# Altium project ESC_Board_Prj.PrjPcb (part 1 of 2)
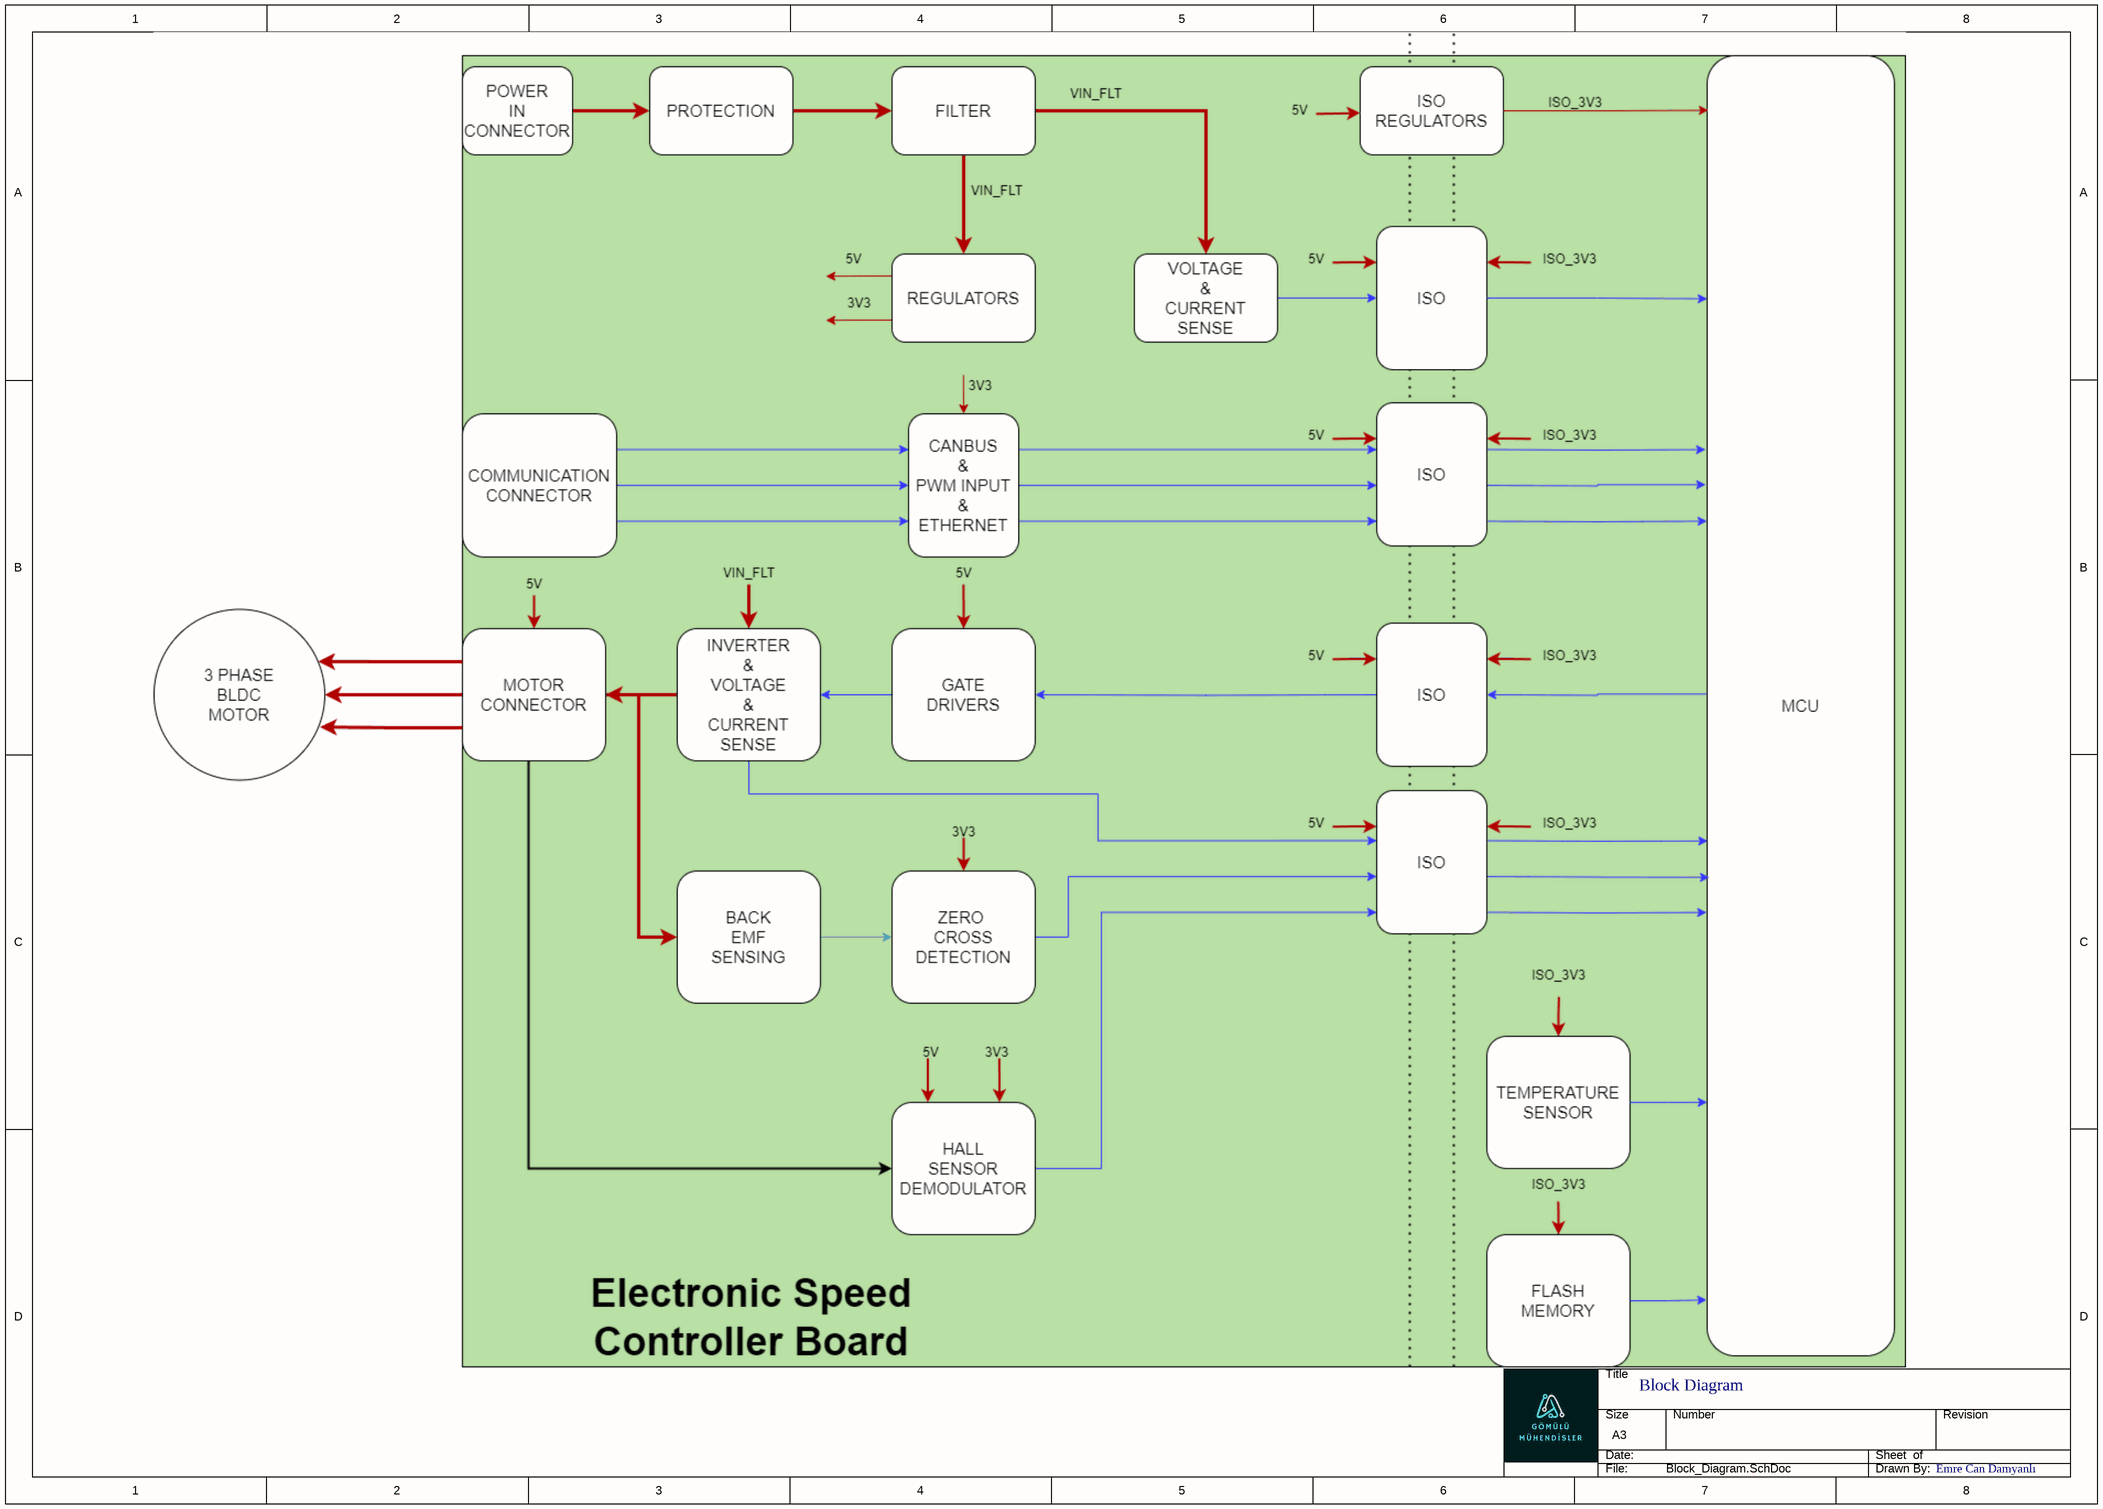
[diagram p0: Block_Diagram.SchDoc]
5 sheets, 72 parts. Net scope: global (net labels, ports and power ports of the same name join across sheets).
Sheets:
  Block_Diagram.SchDoc
  Power_In.SchDoc
  Filter.SchDoc
  Non_Iso_Regulators.SchDoc
  Iso_Regulators.SchDoc

## Sheet Block_Diagram.SchDoc
size A3; SheetNumber: 1; SheetTotal: 4

### Notes on the sheet
- Block Diagram
- Emre Can Damyanlı

## Sheet Power_In.SchDoc
size A4; SheetNumber: 2; SheetTotal: 5
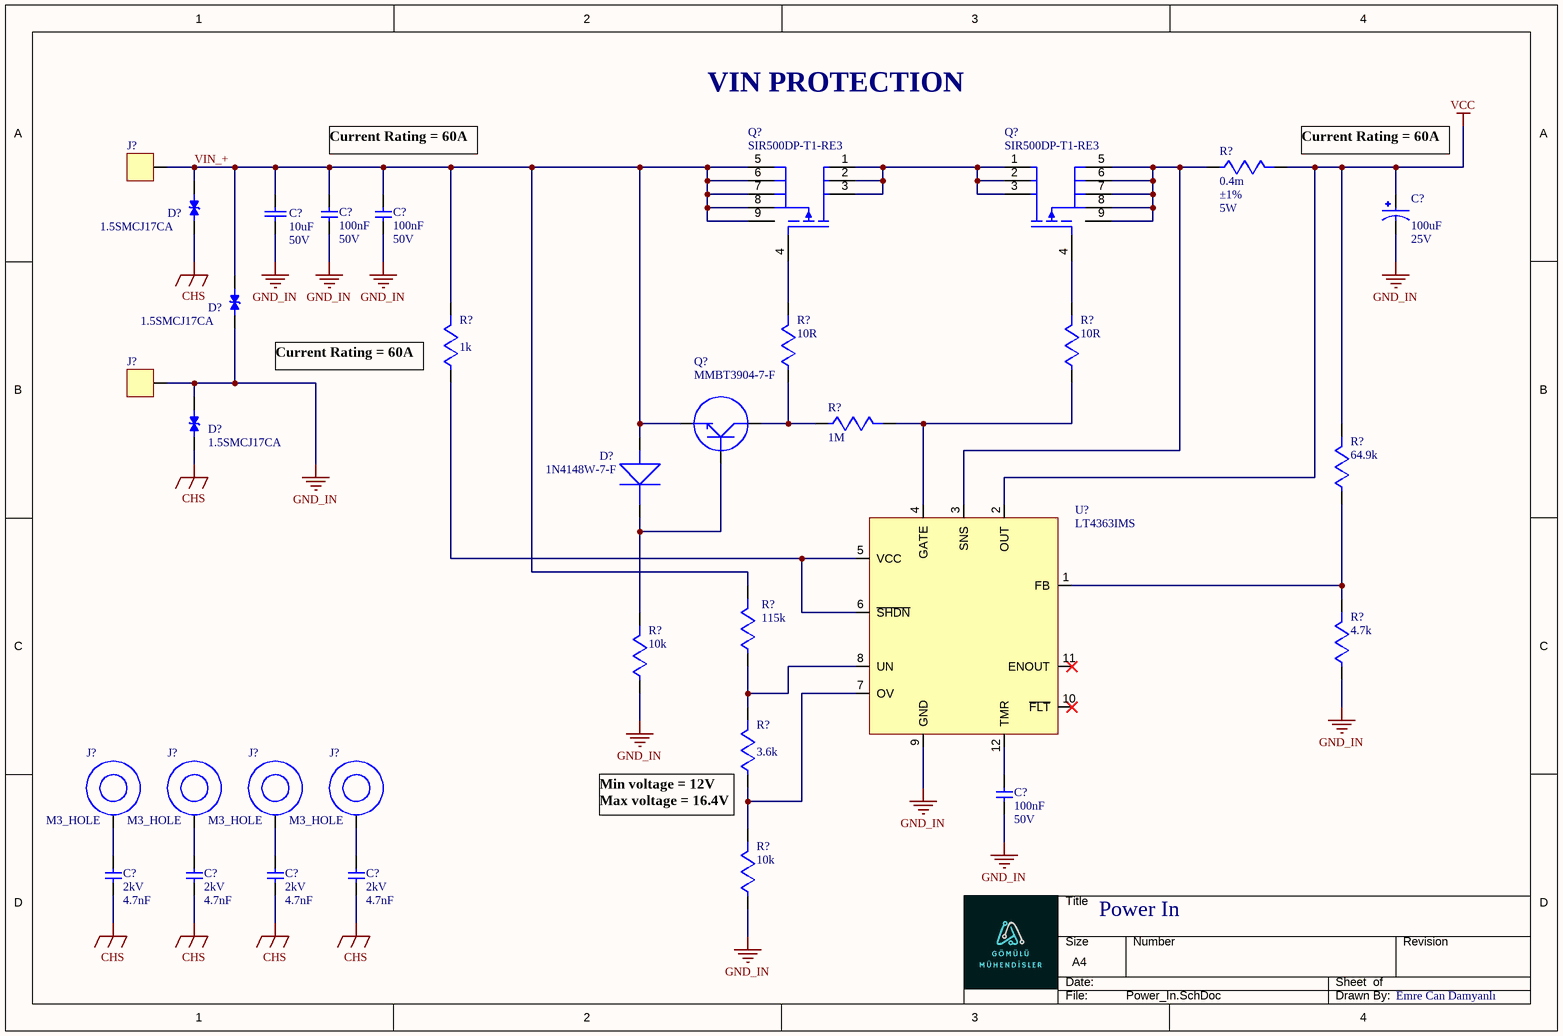
[diagram p1: Power_In.SchDoc]

### Parts
(Parts that share a designator on the sheet are numbered #1, #2 ... from top to bottom, then left to right.)
C?#1  value 100nF  Voltage: 50V  [CAPC3216X160N]  (hidden comment: KAM31NR81H104KU)
C?#2  value 100nF  Voltage: 50V  [CAPC3216X160N]  (hidden comment: KAM31NR81H104KU)
C?#3  value 10uF  Voltage: 50V  [CAPC3216X160N]  (hidden comment: GMC31X5R106M50NT)
C?#4  value 100uF  Voltage: 25V  [CAPMP7343X310N]  (hidden comment: T491X107K025AT)
C?#5  value 100nF  Voltage: 50V  [CAPC3216X160N]  (hidden comment: KAM31NR81H104KU)
C?#6  value 4.7nF  Voltage Rating (DC): 2kV  [CAPC4532X155N]  (hidden comment: C1812C472KGRACAUTO)
C?#7  value 4.7nF  Voltage Rating (DC): 2kV  [CAPC4532X155N]  (hidden comment: C1812C472KGRACAUTO)
C?#8  value 4.7nF  Voltage Rating (DC): 2kV  [CAPC4532X155N]  (hidden comment: C1812C472KGRACAUTO)
C?#9  value 4.7nF  Voltage Rating (DC): 2kV  [CAPC4532X155N]  (hidden comment: C1812C472KGRACAUTO)
D?#1  1.5SMCJ17CA  [DIOM6859X262N]
D?#2  1.5SMCJ17CA  [DIOM6859X262N]
D?#3  1.5SMCJ17CA  [DIOM6859X262N]
D?#4  1N4148W-7-F  [SOD-123F]
J?#1  PAD  [PAD]  (value not drawn)  (no BOM)
J?#2  PAD  [PAD]  (value not drawn)  (no BOM)
J?#3  M3_HOLE  [M3_HOLE]
J?#4  M3_HOLE  [M3_HOLE]
J?#5  M3_HOLE  [M3_HOLE]
J?#6  M3_HOLE  [M3_HOLE]
Q?#1  SIR500DP-T1-RE3  [SIR500DPT1RE3]
Q?#2  SIR500DP-T1-RE3  [SIR500DPT1RE3]
Q?#3  MMBT3904-7-F  [SOT95P230X110-3N]
R?#1  value 0.4m  Tolerance: ±1%  Power Rating: 5W  [RESC6330X90N]  (hidden comment: PU3921FKNP50U4L)
R?#2  value 1k  [RESISTOR_0603]  (hidden comment: RC0603FR-071KL)
R?#3  value 10R  [RESISTOR_0603]  (hidden comment: RC0603FR-0710RL)
R?#4  value 10R  [RESISTOR_0603]  (hidden comment: RC0603FR-0710RL)
R?#5  value 1M  [RESISTOR_0603]  (hidden comment: RC0603FR-071ML)
R?#6  value 64.9k  [RESISTOR_0603]  (hidden comment: RC0603FR-0764K9L)
R?#7  value 115k  [RESISTOR_0603]  (hidden comment: RC0603FR-07115KL)
R?#8  value 4.7k  [RESISTOR_0603]  (hidden comment: RC0603FR-074K7L)
R?#9  value 10k  [RESISTOR_0603]  (hidden comment: RC0603FR-0710KL)
R?#10  value 3.6k  [RESISTOR_0603]  (hidden comment: RC0603FR-073K6L)
R?#11  value 10k  [RESISTOR_0603]  (hidden comment: RC0603FR-0710KL)
U?#1  LT4363IMS  [SOP65P490X110-12N]

### Nets
CHS: C?#6.1 C?#7.1 C?#8.1 C?#9.1 D?#1.1 D?#3.1
GND_IN: C?#1.2 C?#2.2 C?#3.1 C?#4.2 C?#5.2 D?#2.1 D?#3.2 J?#2.1 R?#8.1 R?#9.1 R?#11.1 U?#1.9(GND)
VCC: C?#4.1 R?#1.2 R?#6.2 U?#1.2(OUT)
VIN_+: C?#1.1 C?#2.1 C?#3.2 D?#1.2 D?#2.2 D?#4.1 J?#1.1 Q?#1.5(D_1) Q?#1.6(D_2) Q?#1.7(D_3) Q?#1.8(D_4) Q?#1.9(EP) Q?#3.2(E) R?#2.2 R?#7.2
NetC?#5_1: C?#5.1 U?#1.12(TMR)
NetC?#6_2: C?#6.2 J?#3.1
NetC?#7_2: C?#7.2 J?#4.1
NetC?#8_2: C?#8.2 J?#5.1
NetC?#9_2: C?#9.2 J?#6.1
NetD?#4_2: D?#4.2 Q?#3.1(B) R?#9.2
NetQ?#1_1: Q?#1.1(S_1) Q?#1.2(S_2) Q?#1.3(S_3) Q?#2.1(S_1) Q?#2.2(S_2) Q?#2.3(S_3)
NetQ?#1_4: Q?#1.4(G) R?#3.2
NetQ?#2_4: Q?#2.4(G) R?#4.2
NetQ?#2_5: Q?#2.5(D_1) Q?#2.6(D_2) Q?#2.7(D_3) Q?#2.8(D_4) Q?#2.9(EP) R?#1.1 U?#1.3(SNS)
NetQ?#3_3: Q?#3.3(C) R?#3.1 R?#5.1
NetR?#2_1: R?#2.1 U?#1.5(VCC) U?#1.6(~{SHDN})
NetR?#4_1: R?#4.1 R?#5.2 U?#1.4(GATE)
NetR?#6_1: R?#6.1 R?#8.2 U?#1.1(FB)
NetR?#7_1: R?#7.1 R?#10.2 U?#1.8(UN)
NetR?#10_1: R?#10.1 R?#11.2 U?#1.7(OV)

Not connected (* = marked no-connect by the designer): U?#1 10(~{FLT})* 11(ENOUT)*

### Notes on the sheet
- VIN PROTECTION
- Current Rating = 60A
- (near R?#1) Current Rating = 60A
- (near R?#2) Current Rating = 60A
- (near R?#10) Min voltage = 12V
  Max voltage = 16.4V
- Power In
- Emre Can Damyanlı

### Library data of the parts
C?#1 C?#2 C?#5 = KAM31NR81H104KU: 0.1 µF ±10% 50V Ceramic Capacitor X8R 1206 (3216 Metric); Manufacturer: Kyocera AVX; Supplier: Digi-Key; Supplier Part Number: 478-KAM31NR81H104KUCT-ND; Manufacturer Part Number: KAM31NR81H104KU; RoHS: No; Stock: 245787; Pricing: 1=0,25, 10=0,173, 50=0,1152, 100=0,0979, 500=0,06912, 1000=0,06048 (USD)
C?#3 = GMC31X5R106M50NT: 10 µF ±20% 50V Ceramic Capacitor X5R 1206 (3216 Metric); Manufacturer Part Number: GMC31X5R106M50NT
C?#4 = T491X107K025AT: Cap Tant Solid 100uF 25V X CASE 10% (7.3 X 4.3 X 4mm) Inward L SMD 7343-43 0.3 Ohm 125C T/R; Manufacturer: KEMET; Supplier: Digi-Key; Supplier Part Number: 399-8410-1-ND; Manufacturer Part Number: T491X107K025AT; RoHS: No; Category: Tantalum Capacitors; Stock: 45968; Pricing: 1=2,88, 10=2,328, 50=2,0316, 100=1,7776 (USD); ComponentLink1URL: https://datasheet.ciiva.com/28571/1854511-28571717.pdf?src-supplier=Element14; ComponentLink1Description: https://datasheet.ciiva.com/28571/1854511-28571717.pdf?src-supplier=Element14; ComponentLink2URL: https://datasheet.ciiva.com/6229/kem-t2005-t491-6229625.pdf?src-supplier=Digi-Key; ComponentLink2Description: https://datasheet.ciiva.com/6229/kem-t2005-t491-6229625.pdf?src-supplier=Digi-Key; ComponentLink3URL: https://datasheet.ciiva.com/6229/kem-t2005-t491-6229626.pdf?src-supplier=Digi-Key; ComponentLink3Description: https://datasheet.ciiva.com/6229/kem-t2005-t491-6229626.pdf?src-supplier=Digi-Key; ComponentLink4URL: https://datasheet.ciiva.com/6229/kem-t2005-t491-6229627.pdf?src-supplier=Digi-Key; ComponentLink4Description: https://datasheet.ciiva.com/6229/kem-t2005-t491-6229627.pdf?src-supplier=Digi-Key; ComponentLink5URL: https://datasheet.ciiva.com/22716/1854511-22716393.pdf?src-supplier=Element14; ComponentLink5Description: https://datasheet.ciiva.com/22716/1854511-22716393.pdf?src-supplier=Element14; ComponentLink6URL: https://datasheet.ciiva.com/22716/1854511-22716394.pdf?src-supplier=Element14; ComponentLink6Description: https://datasheet.ciiva.com/22716/1854511-22716394.pdf?src-supplier=Element14
C?#6-C?#9 = C1812C472KGRACAUTO: Ceramic Capacitor, Multilayer, Ceramic, 2000V, 10% +Tol, 10% -Tol, X7R, 15% TC, 0.0047uF, 1812; Manufacturer: KEMET; Dielectric Material: 4241ConductorMaterial; Dielectric: 1511DielectricType; Supplier: Digi-Key; Supplier Part Number: 399-16791-1-ND; Manufacturer Part Number: C1812C472KGRACAUTO; RoHS: Yes; Category: Ceramic Capacitors; Stock: 3537; Pricing: 1=0,73, 10=0,508, 50=0,4278, 100=0,3484, 500=0,29034 (USD); ComponentLink1URL: https://datasheet.octopart.com/C1812C472KGRACAUTO-KEMET-datasheet-169967039.pdf?src-supplier=Newark; ComponentLink1Description: https://datasheet.octopart.com/C1812C472KGRACAUTO-KEMET-datasheet-169967039.pdf?src-supplier=Newark; ComponentLink2URL: https://api.kemet.com/component-edge/download/datasheet/C1812C472KGRACAUTO.pdf?src-supplier=Digi-Key; ComponentLink2Description: https://api.kemet.com/component-edge/download/datasheet/C1812C472KGRACAUTO.pdf?src-supplier=Digi-Key
D?#1-D?#3 = 1.5SMCJ17CA: 27.6V Clamp 54.3A Ipp Tvs Diode Surface Mount SMC/DO-214AB; MP: SMCJ33CA; Value: *; Availability: Unavailable; Price: None; Package: None
D?#4 = 1N4148W-7-F: Small Signal Diode, Single, 100 V, 300 Ma, 1.25 V, 4 Ns, 2 A Rohs Compliant: Yes; Manufacturer: Diodes; Value: 2pF; Forward Current: 150mA; Max Reverse Current: 1uA; Recovery Time: 4ns; Average Rectified Current: 300mA; Max Repetitive Reverse Voltage (Vrrm): 100V; Max Forward Surge Current (Ifsm): 2A; Power Dissipation: 400mW; Forward Voltage: 1.25V; Polarity: Standard; Voltage Rating (DC): 75V; Supplier: Digi-Key; Supplier Part Number: 1N4148W-FDICT-ND; Manufacturer Part Number: 1N4148W-7-F; RoHS: Yes; Category: Rectifier Diodes; Stock: 458934; Pricing: 1=0,17, 10=0,119, 100=0,0644, 500=0,05062, 1000=0,03515 (USD); Mounting Technology: Surface Mount; Pins: 2; Weight: 0.000353oz; Min Operating Temperature: -65°C; Max Operating Temperature: 150°C; Package Quantity: 3000; Packaging: Tape and Reel; Reverse Recovery Time: 4ns; Max Reverse Voltage (DC): 100V; Series: -; Reverse Recovery Time-Max: 4ns; Max Surge Current: 2A; Peak Non-Repetitive Surge Current: 2A; Current Rating: 150mA; Output Current: 150mA; Power Rating: 400mW; Reverse Voltage: 100V; Voltage: 100V; Length: 2.85mm; Width: 1.7mm; Height: 1.25mm; Radiation Hardening: No; Reach SVHC Compliant: No; Lead Free: Lead Free; RoHS Compliant: Yes; ComponentLink1URL: https://datasheet.ciiva.com/1179/1915529-1179304.pdf?src-supplier=Element14; ComponentLink1Description: https://datasheet.ciiva.com/1179/1915529-1179304.pdf?src-supplier=Element14; ComponentLink2URL: https://datasheet.ciiva.com/22695/1915529-22695239.pdf?src-supplier=Element14; ComponentLink2Description: https://datasheet.ciiva.com/22695/1915529-22695239.pdf?src-supplier=Element14; ComponentLink3URL: https://datasheet.ciiva.com/8300/ds30086-8300392.pdf?src-supplier=Avnet; ComponentLink3Description: https://datasheet.ciiva.com/8300/ds30086-8300392.pdf?src-supplier=Avnet; ComponentLink4URL: https://datasheet.ciiva.com/15219/getdatasheetpartid-110030-15219548.pdf?src-supplier=Verical; ComponentLink4Description: https://datasheet.ciiva.com/15219/getdatasheetpartid-110030-15219548.pdf?src-supplier=Verical; ComponentLink5URL: https://datasheet.ciiva.com/4435/ds30086-4435128.pdf?src-supplier=Mouser; ComponentLink5Description: https://datasheet.ciiva.com/4435/ds30086-4435128.pdf?src-supplier=Mouser; ComponentLink6URL: https://datasheet.ciiva.com/8303/ds30086-8303197.pdf?src-supplier=Avnet; ComponentLink6Description: https://datasheet.ciiva.com/8303/ds30086-8303197.pdf?src-supplier=Avnet; ComponentLink7URL: https://datasheet.ciiva.com/911/ds30086-911735.pdf?src-supplier=Digi-Key; ComponentLink7Description: https://datasheet.ciiva.com/911/ds30086-911735.pdf?src-supplier=Digi-Key; ComponentLink8URL: https://datasheet.ciiva.com/911/ds30086-911736.pdf?src-supplier=Digi-Key; ComponentLink8Description: https://datasheet.ciiva.com/911/ds30086-911736.pdf?src-supplier=Digi-Key; ComponentLink9URL: https://datasheet.ciiva.com/911/ds30086-911734.pdf?src-supplier=Digi-Key; ComponentLink9Description: https://datasheet.ciiva.com/911/ds30086-911734.pdf?src-supplier=Digi-Key
Q?#1 Q?#2 = SIR500DP-T1-RE3: Mosfet, N-Ch, 30V, 350.8A, Powerpak So Rohs Compliant: Yes; Manufacturer: Vishay; Supplier: Digi-Key; Supplier Part Number: 742-SIR500DP-T1-RE3CT-ND; Manufacturer Part Number: SIR500DP-T1-RE3; RoHS: Yes; Stock: 5276; Pricing: 1=1,58, 10=1,31, 100=1,0425, 500=0,88208, 1000=0,74843 (USD)
Q?#3 = MMBT3904-7-F: Transistor General Purpose BJT NPN 40 Volt 0.2A Automotive 3-Pin SOT-23; Manufacturer: Diodes Zetex; Max Power Dissipation: 300mW; Collector Emitter Voltage (VCEO): 40V; Max Collector Current: 200mA; Collector Base Voltage (VCBO): 60V; Power Dissipation: 350mW; Frequency: 300MHz; hFE Min: 100; Number of Elements: 1; Emitter Base Voltage (VEBO): 6V; Collector Emitter Saturation Voltage: 300mV; Supplier: Digi-Key; Supplier Part Number: MMBT3904-FDICT-ND; Manufacturer Part Number: MMBT3904-7-F; RoHS: Yes; Category: BJTs; Stock: 5651002; Pricing: 1=0,12, 10=0,086, 100=0,0467, 500=0,03666, 1000=0,02545 (USD); Mounting Technology: Surface Mount; Case/Package: SOT-23; Pins: 3; Weight: 0.000282oz; Min Operating Temperature: -55°C; Max Operating Temperature: 150°C; Polarity: NPN; Packaging: Tape and Reel; Voltage Rating (DC): 40V; Package Quantity: 3000; Transition Frequency: 300MHz; Collector Emitter Breakdown Voltage: 40V; Max Breakdown Voltage: 40V; Continuous Collector Current: 200mA; Clock Frequency: 300MHz; Gain Bandwidth Product: 300MHz; Series: Automotive, AEC-Q101; Collector-emitter Voltage-Max: 300mV; Length: 3.05mm; Width: 1.4mm; Height: 1mm; Radiation Hardening: No; Reach SVHC Compliant: No; Lead Free: Lead Free; RoHS Compliant: Yes; ComponentLink1URL: https://datasheet.ciiva.com/11201/ds30036-11201778.pdf?src-supplier=Avnet; ComponentLink1Description: https://datasheet.ciiva.com/11201/ds30036-11201778.pdf?src-supplier=Avnet; ComponentLink2URL: https://datasheet.ciiva.com/15138/getdatasheetpartid-53265-15138780.pdf?src-supplier=Verical; ComponentLink2Description: https://datasheet.ciiva.com/15138/getdatasheetpartid-53265-15138780.pdf?src-supplier=Verical; ComponentLink3URL: https://datasheet.ciiva.com/22711/1915516-22711750.pdf?src-supplier=Element14; ComponentLink3Description: https://datasheet.ciiva.com/22711/1915516-22711750.pdf?src-supplier=Element14; ComponentLink4URL: https://datasheet.ciiva.com/11198/ds30036-11198999.pdf?src-supplier=Avnet; ComponentLink4Description: https://datasheet.ciiva.com/11198/ds30036-11198999.pdf?src-supplier=Avnet; ComponentLink5URL: https://datasheet.ciiva.com/6361/ds30036-6361256.pdf?src-supplier=Digi-Key; ComponentLink5Description: https://datasheet.ciiva.com/6361/ds30036-6361256.pdf?src-supplier=Digi-Key; ComponentLink6URL: https://datasheet.ciiva.com/6361/ds30036-6361254.pdf?src-supplier=Digi-Key; ComponentLink6Description: https://datasheet.ciiva.com/6361/ds30036-6361254.pdf?src-supplier=Digi-Key
R?#1 = PU3921FKNP50U4L: Shunt Chip Resistor Metal Plate 3921 0.4mOhm 1% Emboss T/R; Manufacturer: Yageo; Supplier: Digi-Key; Supplier Part Number: YAG6129CT-ND; Manufacturer Part Number: PU3921FKNP50U4L; RoHS: Yes; Category: Chip SMD Resistors; Stock: 3221; Pricing: 1=1,72, 10=1,445, 25=1,4008, 50=1,2778, 100=1,0469, 250=0,93384, 500=0,7864, 1000=0,65369 (USD); ComponentLink1URL: https://www.yageo.com/upload/media/product/productsearch/datasheet/rchip/PYu-PU_51_RoHS_L_6.pdf?src-supplier=Digi-Key; ComponentLink1Description: https://www.yageo.com/upload/media/product/productsearch/datasheet/rchip/PYu-PU_51_RoHS_L_6.pdf?src-supplier=Digi-Key; ComponentLink2URL: https://datasheet.octopart.com/PU3921FKNP50U4L-Yageo-datasheet-164512547.pdf?src-supplier=Future+Electronics; ComponentLink2Description: https://datasheet.octopart.com/PU3921FKNP50U4L-Yageo-datasheet-164512547.pdf?src-supplier=Future+Electronics
R?#2 = RC0603FR-071KL: SMD Chip Resistor, 1 kOhm, ± 1%, 100 mW, 0603 [1608 Metric], Thick Film, General Purpose; Manufacturer: Yageo; Temperature Coefficient: 100ppm/°C; Power Rating: 100mW; Voltage Rating: 50V; Supplier: Digi-Key; Supplier Part Number: 311-1.00KHRCT-ND; Manufacturer Part Number: RC0603FR-071KL; RoHS: Yes; Category: Chip SMD Resistors; Stock: 18662657; Pricing: 1=0,1, 10=0,018, 50=0,0106, 100=0,0088, 500=0,00592, 1000=0,00505 (USD); Case/Package: 0603; Contact Plating: Tin,Matte; Case Code (Imperial): 0603; Case Code (Metric): 1608; Min Operating Temperature: -55°C; Max Operating Temperature: 155°C; Tolerance: 1%; Resistor Type: Thick Film; Packaging: Tape and Reel; Termination: SMD/SMT; Features: Moisture Resistant; Series: RC; Max Power Dissipation: 100mW; Number of Terminations: 2; Technology: THICK FILM; Resistance Tolerance: 1%; Construction: Rectangular; Length: 1.6mm; Height: 0.45mm; Depth: 0.8mm; Reach SVHC Compliant: No; Military Standard: Not; RoHS Compliant: Yes
R?#3 R?#4 = RC0603FR-0710RL: SMD Chip Resistor, 10 Ohm, ± 1%, 100 mW, 0603 [1608 Metric], Thick Film, General Purpose; Manufacturer: Yageo; Voltage Rating (DC): 50V; Temperature Coefficient: 200ppm/°C; Max Power Dissipation: 100mW; Supplier: Digi-Key; Supplier Part Number: 311-10.0HRCT-ND; Manufacturer Part Number: RC0603FR-0710RL; RoHS: Yes; Category: Chip SMD Resistors; Stock: 1593496; Pricing: 1=0,1, 10=0,028, 50=0,018, 100=0,015, 500=0,0104, 1000=0,00901 (USD); Case/Package: 0603; Pins: 2; Case Code (Imperial): 0603; Case Code (Metric): 1608; Contact Plating: Tin,Matte; Min Operating Temperature: -55°C; Max Operating Temperature: 155°C; Packaging: Tape and Reel; Tolerance: 1%; Features: Moisture Resistant; Series: RC; Number of Terminations: 2; Power Rating: 100mW; Voltage Rating: 50V; Termination: SMD/SMT; Resistor Type: Thick Film; Resistance Tolerance: 1%; Construction: Rectangular; Technology: THICK FILM; Voltage Rating (AC): 50V; Length: 1.6mm; Width: 0.8mm; Height: 0.45mm; Depth: 0.8mm; Lead Free: Lead Free; RoHS Compliant: Yes; Reach SVHC Compliant: No; Military Standard: Not; ComponentLink1URL: https://datasheet.ciiva.com/11808/0900766b80f96399-11808140.pdf?src-supplier=Rs; ComponentLink1Description: https://datasheet.ciiva.com/11808/0900766b80f96399-11808140.pdf?src-supplier=Rs; ComponentLink2URL: https://datasheet.ciiva.com/7746/443971-7746245.pdf?src-supplier=Element14; ComponentLink2Description: https://datasheet.ciiva.com/7746/443971-7746245.pdf?src-supplier=Element14; ComponentLink3URL: https://datasheet.ciiva.com/8891/pyu-rc0603-51-rohs-l-4-8891285.pdf?src-supplier=Avnet; ComponentLink3Description: https://datasheet.ciiva.com/8891/pyu-rc0603-51-rohs-l-4-8891285.pdf?src-supplier=Avnet
R?#5 = RC0603FR-071ML: SMD Chip Resistor, 1 MOhm, ± 1%, 100 mW, 0603 [1608 Metric], Thick Film, General Purpose; Manufacturer: Yageo; Voltage Rating: 75V; Power Rating: 100mW; Temperature Coefficient: 100ppm/°C; Application(s): HIGH RELIABILITY; Supplier: Digi-Key; Supplier Part Number: 311-1.00MHRCT-ND; Manufacturer Part Number: RC0603FR-071ML; RoHS: Yes; Category: Chip SMD Resistors; Stock: 1709958; Pricing: 1=0,1, 10=0,018, 50=0,011, 100=0,009, 500=0,00606, 1000=0,00517 (USD); Case Code (Imperial): 0603; Case Code (Metric): 1608; Weight: 0.000847oz; Min Operating Temperature: -55°C; Max Operating Temperature: 155°C; Tolerance: 1%; Packaging: Cut Tape; Package Quantity: 5000; Termination: SMD/SMT; Type: General Purpose; Series: RC; Technology: THICK FILM; Diameter: 10mm; Length: 1.6mm; Width: 0.8mm; Height: 0.45mm; Lead Pitch: 5mm; Radiation Hardening: 5898YesNo; RoHS Compliant: Yes; Lead Free: 5697LeadFree; ComponentLink1URL: https://datasheet.ciiva.com/11819/0900766b80f96399-11819295.pdf?src-supplier=Rs; ComponentLink1Description: https://datasheet.ciiva.com/11819/0900766b80f96399-11819295.pdf?src-supplier=Rs; ComponentLink2URL: https://datasheet.ciiva.com/7983/443971-7983614.pdf?src-supplier=Element14; ComponentLink2Description: https://datasheet.ciiva.com/7983/443971-7983614.pdf?src-supplier=Element14; ComponentLink3URL: https://datasheet.ciiva.com/12555/rc0603-272842-12555388.pdf?src-supplier=Mouser; ComponentLink3Description: https://datasheet.ciiva.com/12555/rc0603-272842-12555388.pdf?src-supplier=Mouser
R?#6 = RC0603FR-0764K9L: SMD Chip Resistor, 64.9 kOhm, ± 1%, 100 mW, 0603 [1608 Metric], Thick Film, General Purpose; Manufacturer: Yageo; Supplier: Digi-Key; Supplier Part Number: 311-64.9KHRCT-ND; Manufacturer Part Number: RC0603FR-0764K9L; RoHS: Yes; Category: Chip SMD Resistors; Stock: 313620; Pricing: 1=0,1, 10=0,018, 50=0,0106, 100=0,0088, 500=0,00592, 1000=0,00505 (USD); ComponentLink1URL: https://datasheet.ciiva.com/11819/0900766b80f96399-11819415.pdf?src-supplier=Rs; ComponentLink1Description: https://datasheet.ciiva.com/11819/0900766b80f96399-11819415.pdf?src-supplier=Rs
R?#7 = RC0603FR-07115KL: SMD Chip Resistor, 115 kOhm, ± 1%, 100 mW, 0603 [1608 Metric], Thick Film, General Purpose; Manufacturer: Yageo; Voltage Rating (DC): 50V; Supplier: Digi-Key; Supplier Part Number: 311-115KHRCT-ND; Manufacturer Part Number: RC0603FR-07115KL; RoHS: Yes; Category: Chip SMD Resistors; Stock: 169456; Pricing: 1=0,1, 10=0,018, 50=0,0106, 100=0,0088, 500=0,00592, 1000=0,00505 (USD); Lead Free: 5697LeadFree; ComponentLink1URL: https://datasheet.ciiva.com/8887/pyu-rc0603-51-rohs-l-4-8887692.pdf?src-supplier=Avnet; ComponentLink1Description: https://datasheet.ciiva.com/8887/pyu-rc0603-51-rohs-l-4-8887692.pdf?src-supplier=Avnet; ComponentLink2URL: https://datasheet.ciiva.com/2455/pyu-r-int-thick-7-2455086.pdf?src-supplier=Digi-Key; ComponentLink2Description: https://datasheet.ciiva.com/2455/pyu-r-int-thick-7-2455086.pdf?src-supplier=Digi-Key; ComponentLink3URL: https://datasheet.ciiva.com/2455/pyu-r-int-thick-7-2455087.pdf?src-supplier=Digi-Key; ComponentLink3Description: https://datasheet.ciiva.com/2455/pyu-r-int-thick-7-2455087.pdf?src-supplier=Digi-Key; ComponentLink4URL: https://datasheet.ciiva.com/2455/pyu-r-int-thick-7-2455088.pdf?src-supplier=Digi-Key; ComponentLink4Description: https://datasheet.ciiva.com/2455/pyu-r-int-thick-7-2455088.pdf?src-supplier=Digi-Key
R?#8 = RC0603FR-074K7L: SMD Chip Resistor, 4.7 kOhm, ± 1%, 100 mW, 0603 [1608 Metric], Thick Film, General Purpose; Manufacturer: Yageo; Power Rating: 100mW; Voltage Rating (DC): 50V; Temperature Coefficient: 100ppm/°C; Supplier: Digi-Key; Supplier Part Number: 311-4.70KHRCT-ND; Manufacturer Part Number: RC0603FR-074K7L; RoHS: Yes; Category: Chip SMD Resistors; Stock: 7233601; Pricing: 1=0,1, 10=0,018, 50=0,0106, 100=0,0088, 500=0,00592, 1000=0,00505 (USD); Case/Package: 0603; Pins: 2; Case Code (Imperial): 0603; Case Code (Metric): 1608; Min Operating Temperature: -55°C; Max Operating Temperature: 155°C; Tolerance: 1%; Resistor Type: Thick Film; Packaging: Tape and Reel; Voltage Rating: 50V; Termination: SMD/SMT; Features: Moisture Resistant; Series: RC; Max Power Dissipation: 100mW; Number of Terminations: 2; Construction: Rectangular; Resistance Tolerance: 1%; Length: 1.6mm; Width: 0.8mm; Depth: 0.8mm; Lead Pitch: 0.3mm; Lead Free: Lead Free; Reach SVHC Compliant: Unknown; RoHS Compliant: Yes; Military Standard: Not; ComponentLink1URL: https://datasheet.ciiva.com/15189/getdatasheetpartid-422754-15189760.pdf?src-supplier=Verical; ComponentLink1Description: https://datasheet.ciiva.com/15189/getdatasheetpartid-422754-15189760.pdf?src-supplier=Verical; ComponentLink2URL: https://datasheet.ciiva.com/7660/38590-7660794.pdf?src-supplier=Element14; ComponentLink2Description: https://datasheet.ciiva.com/7660/38590-7660794.pdf?src-supplier=Element14; ComponentLink3URL: https://datasheet.ciiva.com/22747/443971-22747528.pdf?src-supplier=Element14; ComponentLink3Description: https://datasheet.ciiva.com/22747/443971-22747528.pdf?src-supplier=Element14; ComponentLink4URL: https://datasheet.ciiva.com/46440/1868787-46440909.pdf?src-supplier=Element14; ComponentLink4Description: https://datasheet.ciiva.com/46440/1868787-46440909.pdf?src-supplier=Element14; ComponentLink5URL: https://datasheet.ciiva.com/7746/1868787-7746365.pdf?src-supplier=Element14; ComponentLink5Description: https://datasheet.ciiva.com/7746/1868787-7746365.pdf?src-supplier=Element14; ComponentLink6URL: https://datasheet.ciiva.com/7746/1738695-7746366.pdf?src-supplier=Element14; ComponentLink6Description: https://datasheet.ciiva.com/7746/1738695-7746366.pdf?src-supplier=Element14
R?#9 R?#11 = RC0603FR-0710KL: SMD Chip Resistor, 10 kOhm, ± 1%, 100 mW, 0603 [1608 Metric], Thick Film, General Purpose; Manufacturer: Yageo; Voltage Rating (DC): 50V; Temperature Coefficient: 100ppm/°C; Power Rating: 100mW; Voltage Rating: 75V; Supplier: Digi-Key; Supplier Part Number: 311-10.0KHRCT-ND; Manufacturer Part Number: RC0603FR-0710KL; RoHS: Yes; Category: Chip SMD Resistors; Stock: 19409735; Pricing: 1=0,1, 10=0,018, 50=0,0106, 100=0,0088, 500=0,00592, 1000=0,00505 (USD); Case/Package: 0603; Pins: 2; Case Code (Imperial): 0603; Case Code (Metric): 1608; Weight: 7.1E-05oz; Min Operating Temperature: -55°C; Max Operating Temperature: 155°C; Tolerance: 1%; Resistor Type: Thick Film; Packaging: Tape and Reel; Termination: SMD/SMT; Features: Moisture Resistant; Series: RC; Max Power Dissipation: 100mW; Number of Terminations: 2; Resistance Tolerance: 1%; Construction: Rectangular; Length: 1.6mm; Width: 0.8mm; Height: 0.45mm; Depth: 0.8mm; Lead Pitch: 0.3mm; Reach SVHC Compliant: No; Lead Free: 5697LeadFree; Military Standard: Not; RoHS Compliant: Yes; ComponentLink1URL: https://datasheet.ciiva.com/7660/38590-7660789.pdf?src-supplier=Element14; ComponentLink1Description: https://datasheet.ciiva.com/7660/38590-7660789.pdf?src-supplier=Element14; ComponentLink2URL: https://datasheet.ciiva.com/7983/443971-7983596.pdf?src-supplier=Element14; ComponentLink2Description: https://datasheet.ciiva.com/7983/443971-7983596.pdf?src-supplier=Element14; ComponentLink3URL: https://datasheet.ciiva.com/22747/443971-22747519.pdf?src-supplier=Element14; ComponentLink3Description: https://datasheet.ciiva.com/22747/443971-22747519.pdf?src-supplier=Element14; ComponentLink4URL: https://datasheet.ciiva.com/46440/1868787-46440891.pdf?src-supplier=Element14; ComponentLink4Description: https://datasheet.ciiva.com/46440/1868787-46440891.pdf?src-supplier=Element14; ComponentLink5URL: https://datasheet.ciiva.com/7746/1738695-7746239.pdf?src-supplier=Element14; ComponentLink5Description: https://datasheet.ciiva.com/7746/1738695-7746239.pdf?src-supplier=Element14; ComponentLink6URL: https://datasheet.ciiva.com/15189/getdatasheetpartid-409289-15189591.pdf?src-supplier=Verical; ComponentLink6Description: https://datasheet.ciiva.com/15189/getdatasheetpartid-409289-15189591.pdf?src-supplier=Verical
R?#10 = RC0603FR-073K6L: SMD Chip Resistor, 3.6 kOhm, ± 1%, 100 mW, 0603 [1608 Metric], Thick Film, General Purpose; Manufacturer: Yageo; Power Rating: 100mW; Voltage Rating: 50V; Temperature Coefficient: 100ppm/°C; Working Voltage: 75V; Nominal Supply Voltage (DC): 5V; Output Current: 10mA; Max Supply Voltage: 5.5V; Min Supply Voltage: 4.5V; Supplier: Digi-Key; Supplier Part Number: 311-3.60KHRCT-ND; Manufacturer Part Number: RC0603FR-073K6L; RoHS: Yes; Category: Chip SMD Resistors; Stock: 186029; Pricing: 1=0,1, 10=0,018, 50=0,0106, 100=0,0088, 500=0,00592, 1000=0,00505 (USD); Case/Package: 0603; Pins: 2; Case Code (Imperial): 0603; Case Code (Metric): 1608; Min Operating Temperature: -55°C; Max Operating Temperature: 155°C; Tolerance: 1%; Package Quantity: 5000; Packaging: Tape and Reel; Termination: SMD/SMT; Resistor Type: Thick Film; Number of Terminations: 2; Max Power Dissipation: 100mW; Voltage Rating (DC): 50V; Features: Moisture Resistant; Series: RC; Technology: METAL OXIDE FILM; Resistance Tolerance: 1%; Length: 1.6mm; Width: 0.8mm; Height: 0.45mm; Radiation Hardening: 5898YesNo; RoHS Compliant: Yes; Reach SVHC Compliant: Unknown; Lead Free: 5697LeadFree; ComponentLink1URL: https://datasheet.ciiva.com/2455/pyu-r-int-thick-7-2455117.pdf?src-supplier=Digi-Key; ComponentLink1Description: https://datasheet.ciiva.com/2455/pyu-r-int-thick-7-2455117.pdf?src-supplier=Digi-Key; ComponentLink2URL: https://datasheet.ciiva.com/2455/pyu-r-int-thick-7-2455118.pdf?src-supplier=Digi-Key; ComponentLink2Description: https://datasheet.ciiva.com/2455/pyu-r-int-thick-7-2455118.pdf?src-supplier=Digi-Key; ComponentLink3URL: https://datasheet.ciiva.com/2455/pyu-r-int-thick-7-2455116.pdf?src-supplier=Digi-Key; ComponentLink3Description: https://datasheet.ciiva.com/2455/pyu-r-int-thick-7-2455116.pdf?src-supplier=Digi-Key
U?#1 = LT4363IMS-2#TRPBF: IC SURGE STOPPER HV 12-MSOP; Manufacturer: Analog Devices / Linear Technology; Working Voltage: 80V; Clamping Voltage: 27V; Number of Circuits: 1; Supplier: Digi-Key; Supplier Part Number: LT4363IMS-2#TRPBFCT-ND; Manufacturer Part Number: LT4363IMS-2#TRPBF; RoHS: Yes; Category: Voltage Supervisors; Stock: 13263; Pricing: 1=8,22, 10=7,427, 25=7,0812, 100=6,1485, 250=5,87216, 500=5,354, 1000=4,66317 (USD); Case/Package: TSSOP; Pins: 12; Package Quantity: 2500; Packaging: Tape and Reel; Lead Free: Lead Free; RoHS Compliant: Yes; ComponentLink1URL: https://datasheet.ciiva.com/329/40854-329672.pdf?src-supplier=Digi-Key; ComponentLink1Description: https://datasheet.ciiva.com/329/40854-329672.pdf?src-supplier=Digi-Key

## Sheet Filter.SchDoc
size A4; SheetNumber: 3; SheetTotal: 5
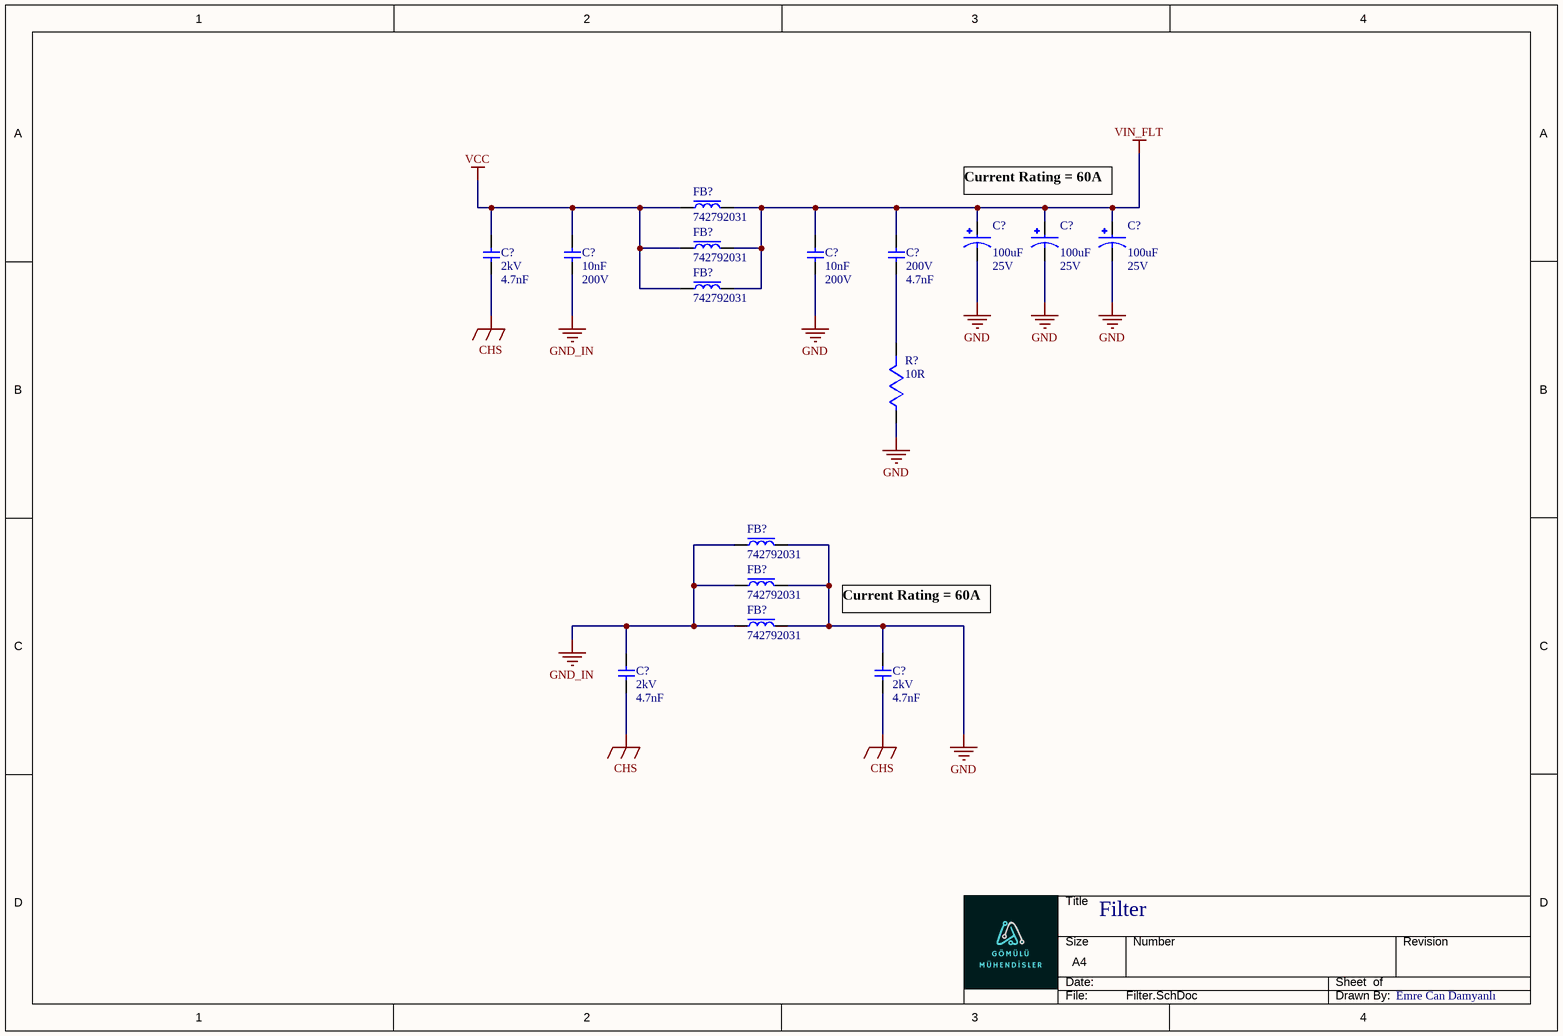
[diagram p2: Filter.SchDoc]

### Parts
(Parts that share a designator on the sheet are numbered #1, #2 ... from top to bottom, then left to right.)
C?#10  value 4.7nF  Voltage Rating (DC): 2kV  [CAPC4532X155N]  (hidden comment: C1812C472KGRACAUTO)
C?#11  value 10nF  Voltage: 200V  [CAPC3216X160N]  (hidden comment: C1206C103K2REC7800)
C?#12  value 10nF  Voltage: 200V  [CAPC3216X160N]  (hidden comment: C1206C103K2REC7800)
C?#13  value 4.7nF  Voltage Rating: 200V  (hidden comment: C1206C472J2GECAUTO)
C?#14  value 100uF  Voltage: 25V  (hidden comment: T491X107K025AT)
C?#15  value 100uF  Voltage: 25V  (hidden comment: T491X107K025AT)
C?#16  value 100uF  Voltage: 25V  (hidden comment: T491X107K025AT)
C?#17  value 4.7nF  Voltage Rating (DC): 2kV  [CAPC4532X155N]  (hidden comment: C1812C472KGRACAUTO)
C?#18  value 4.7nF  Voltage Rating (DC): 2kV  [CAPC4532X155N]  (hidden comment: C1812C472KGRACAUTO)
FB?#1  742792031  [BLE32SN120SH1L]
FB?#2  742792031  [BLE32SN120SH1L]
FB?#3  742792031  [BLE32SN120SH1L]
FB?#4  742792031  [BLE32SN120SH1L]
FB?#5  742792031  [BLE32SN120SH1L]
FB?#6  742792031  [BLE32SN120SH1L]
R?#12  value 10R  [RESISTOR_0603]  (hidden comment: RC0603FR-0710RL)

### Nets
CHS: C?#10.1 C?#17.1 C?#18.1
GND: C?#12.1 C?#14.2 C?#15.2 C?#16.2 C?#18.2 FB?#4.2 FB?#5.2 FB?#6.2 R?#12.1
GND_IN: C?#11.1 C?#17.2 FB?#4.1 FB?#5.1 FB?#6.1
VCC: C?#10.2 C?#11.2 FB?#1.1 FB?#2.1 FB?#3.1
VIN_FLT: C?#12.2 C?#13.2 C?#14.1 C?#15.1 C?#16.1 FB?#1.2 FB?#2.2 FB?#3.2
NetC?#13_1: C?#13.1 R?#12.2

### Notes on the sheet
- (near C?#14) Current Rating = 60A
- Current Rating = 60A
- Filter
- Emre Can Damyanlı

### Library data of the parts
C?#10 C?#17 C?#18 = C1812C472KGRACAUTO: as C?#6 on sheet Power_In; Supplier: Digi-Key; Supplier Part Number: 399-16791-1-ND; Manufacturer Part Number: C1812C472KGRACAUTO; RoHS: Yes; Category: Ceramic Capacitors; Stock: 3537; Pricing: 1=0,73, 10=0,508, 50=0,4278, 100=0,3484, 500=0,29034 (USD); ComponentLink1URL: https://datasheet.octopart.com/C1812C472KGRACAUTO-KEMET-datasheet-169967039.pdf?src-supplier=Newark; ComponentLink1Description: https://datasheet.octopart.com/C1812C472KGRACAUTO-KEMET-datasheet-169967039.pdf?src-supplier=Newark; ComponentLink2URL: https://api.kemet.com/component-edge/download/datasheet/C1812C472KGRACAUTO.pdf?src-supplier=Digi-Key; ComponentLink2Description: https://api.kemet.com/component-edge/download/datasheet/C1812C472KGRACAUTO.pdf?src-supplier=Digi-Key
C?#11 C?#12 = C1206C103K2REC7800: Cap Cer 1206 10NF 200V X7R 10%; Manufacturer: KEMET; Supplier: Digi-Key; Supplier Part Number: 399-C1206C103K2REC7800CT-ND; Manufacturer Part Number: C1206C103K2REC7800; RoHS: No; Category: Ceramic Capacitors; Stock: 7100; Pricing: 1=0,2, 10=0,127, 50=0,0804, 100=0,0643, 500=0,04642, 1000=0,04107 (USD)
C?#13 = C1206C472J2GECAUTO: Cap Cer 1206 4.7NF 200V C0G 5%; Manufacturer: KEMET; Supplier: Digi-Key; Supplier Part Number: 399-C1206C472J2GECAUTOCT-ND; Manufacturer Part Number: C1206C472J2GECAUTO; RoHS: Yes; Category: Ceramic Capacitors; Stock: 3910; Pricing: 1=0,43, 10=0,285, 50=0,21, 100=0,171, 500=0,135, 1000=0,114 (USD); Mounting Technology: Surface Mount; Case/Package: 1206; Min Operating Temperature: -55°C; Max Operating Temperature: 125°C; Series: ESD SMD Auto C0G; Packaging: Tape and Reel; Tolerance: 5%; Ratings: AEC-Q200; RoHS Compliant: Yes; ComponentLink1URL: https://api.kemet.com/component-edge/download/datasheet/C1206C472J2GECAUTO.pdf?src-supplier=Digi-Key; ComponentLink1Description: https://api.kemet.com/component-edge/download/datasheet/C1206C472J2GECAUTO.pdf?src-supplier=Digi-Key
C?#14-C?#16 = T491X107K025AT: as C?#4 on sheet Power_In; Supplier: Digi-Key; Supplier Part Number: 399-8410-1-ND; Manufacturer Part Number: T491X107K025AT; RoHS: No; Category: Tantalum Capacitors; Stock: 45968; Pricing: 1=2,88, 10=2,328, 50=2,0316, 100=1,7776 (USD); ComponentLink1URL: https://datasheet.ciiva.com/28571/1854511-28571717.pdf?src-supplier=Element14; ComponentLink1Description: https://datasheet.ciiva.com/28571/1854511-28571717.pdf?src-supplier=Element14; ComponentLink2URL: https://datasheet.ciiva.com/6229/kem-t2005-t491-6229625.pdf?src-supplier=Digi-Key; ComponentLink2Description: https://datasheet.ciiva.com/6229/kem-t2005-t491-6229625.pdf?src-supplier=Digi-Key; ComponentLink3URL: https://datasheet.ciiva.com/6229/kem-t2005-t491-6229626.pdf?src-supplier=Digi-Key; ComponentLink3Description: https://datasheet.ciiva.com/6229/kem-t2005-t491-6229626.pdf?src-supplier=Digi-Key; ComponentLink4URL: https://datasheet.ciiva.com/6229/kem-t2005-t491-6229627.pdf?src-supplier=Digi-Key; ComponentLink4Description: https://datasheet.ciiva.com/6229/kem-t2005-t491-6229627.pdf?src-supplier=Digi-Key; ComponentLink5URL: https://datasheet.ciiva.com/22716/1854511-22716393.pdf?src-supplier=Element14; ComponentLink5Description: https://datasheet.ciiva.com/22716/1854511-22716393.pdf?src-supplier=Element14; ComponentLink6URL: https://datasheet.ciiva.com/22716/1854511-22716394.pdf?src-supplier=Element14; ComponentLink6Description: https://datasheet.ciiva.com/22716/1854511-22716394.pdf?src-supplier=Element14
FB?#1-FB?#6 = BLE32SN120SH1L: 12 Ohms @ 100 MHz 1 Power Line Ferrite Bead 1210 (3225 Metric) 20A 0.6mOhm; Manufacturer Part Number: 742792031
R?#12 = RC0603FR-0710RL: as R?#3 on sheet Power_In; Supplier: Digi-Key; Supplier Part Number: 311-10.0HRCT-ND; Manufacturer Part Number: RC0603FR-0710RL; RoHS: Yes; Category: Chip SMD Resistors; Stock: 1593496; Pricing: 1=0,1, 10=0,028, 50=0,018, 100=0,015, 500=0,0104, 1000=0,00901 (USD); Case/Package: 0603; Pins: 2; Case Code (Imperial): 0603; Case Code (Metric): 1608; Contact Plating: Tin,Matte; Min Operating Temperature: -55°C; Max Operating Temperature: 155°C; Packaging: Tape and Reel; Tolerance: 1%; Features: Moisture Resistant; Series: RC; Number of Terminations: 2; Power Rating: 100mW; Voltage Rating: 50V; Termination: SMD/SMT; Resistor Type: Thick Film; Resistance Tolerance: 1%; Construction: Rectangular; Technology: THICK FILM; Voltage Rating (AC): 50V; Length: 1.6mm; Width: 0.8mm; Height: 0.45mm; Depth: 0.8mm; Lead Free: Lead Free; RoHS Compliant: Yes; Reach SVHC Compliant: No; Military Standard: Not; ComponentLink1URL: https://datasheet.ciiva.com/11808/0900766b80f96399-11808140.pdf?src-supplier=Rs; ComponentLink1Description: https://datasheet.ciiva.com/11808/0900766b80f96399-11808140.pdf?src-supplier=Rs; ComponentLink2URL: https://datasheet.ciiva.com/7746/443971-7746245.pdf?src-supplier=Element14; ComponentLink2Description: https://datasheet.ciiva.com/7746/443971-7746245.pdf?src-supplier=Element14; ComponentLink3URL: https://datasheet.ciiva.com/8891/pyu-rc0603-51-rohs-l-4-8891285.pdf?src-supplier=Avnet; ComponentLink3Description: https://datasheet.ciiva.com/8891/pyu-rc0603-51-rohs-l-4-8891285.pdf?src-supplier=Avnet